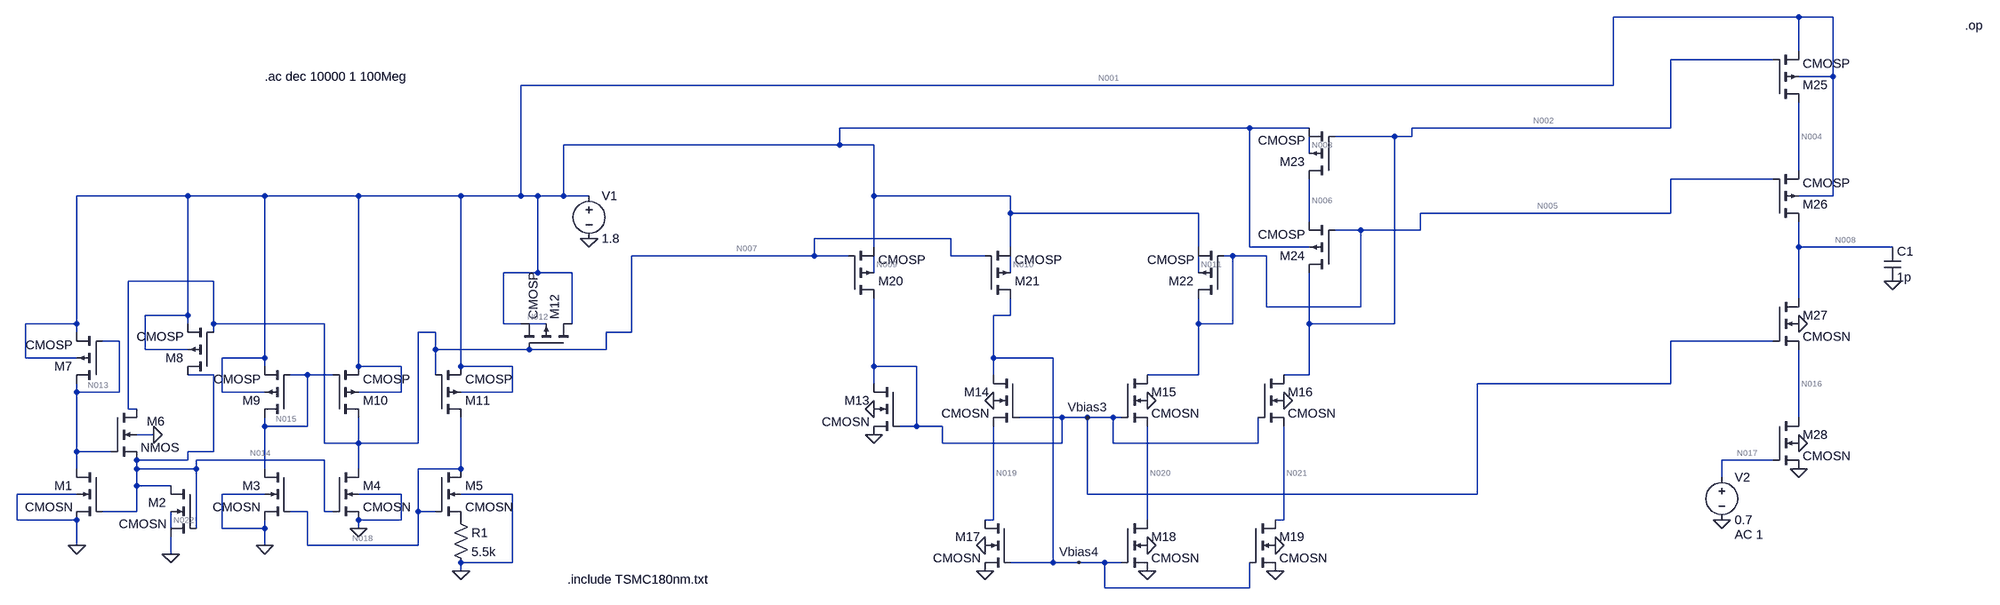
[diagram p0: schematic 180nm.asc]
180nm.asc, the LTspice schematic file:
Version 4
SHEET 1 4024 680
WIRE 3648 -656 3232 -656
WIRE 3712 -656 3648 -656
WIRE 3648 -592 3648 -656
WIRE 3600 -576 3408 -576
WIRE 3712 -544 3712 -656
WIRE 3712 -544 3648 -544
WIRE 3232 -528 3232 -656
WIRE 3232 -528 848 -528
WIRE 2304 -448 1536 -448
WIRE 2416 -448 2304 -448
WIRE 3408 -448 3408 -576
WIRE 3408 -448 2608 -448
WIRE 2576 -432 2464 -432
WIRE 2608 -432 2608 -448
WIRE 2608 -432 2576 -432
WIRE 1536 -416 1536 -448
WIRE 1536 -416 928 -416
WIRE 1600 -416 1536 -416
WIRE 2416 -400 2416 -432
WIRE 3648 -368 3648 -496
WIRE 3600 -352 3408 -352
WIRE 224 -320 16 -320
WIRE 368 -320 224 -320
WIRE 544 -320 368 -320
WIRE 736 -320 544 -320
WIRE 848 -320 848 -528
WIRE 848 -320 736 -320
WIRE 880 -320 848 -320
WIRE 928 -320 928 -416
WIRE 928 -320 880 -320
WIRE 976 -320 928 -320
WIRE 1600 -320 1600 -416
WIRE 1856 -320 1600 -320
WIRE 3712 -320 3712 -544
WIRE 3712 -320 3648 -320
WIRE 1856 -288 1856 -320
WIRE 2208 -288 1856 -288
WIRE 3408 -288 3408 -352
WIRE 3408 -288 2624 -288
WIRE 2416 -272 2416 -352
WIRE 2512 -256 2464 -256
WIRE 2624 -256 2624 -288
WIRE 2624 -256 2512 -256
WIRE 1744 -240 1488 -240
WIRE 1600 -224 1600 -320
WIRE 1856 -224 1856 -288
WIRE 2208 -224 2208 -288
WIRE 2304 -224 2304 -448
WIRE 2416 -224 2304 -224
WIRE 3648 -224 3648 -272
WIRE 3824 -224 3648 -224
WIRE 1488 -208 1488 -240
WIRE 1488 -208 1056 -208
WIRE 1552 -208 1488 -208
WIRE 1744 -208 1744 -240
WIRE 1808 -208 1744 -208
WIRE 2272 -208 2256 -208
WIRE 2336 -208 2272 -208
WIRE 880 -176 880 -320
WIRE 880 -176 816 -176
WIRE 944 -176 880 -176
WIRE 1600 -176 1600 -208
WIRE 1856 -176 1856 -208
WIRE 2208 -176 2208 -208
WIRE 272 -160 112 -160
WIRE 3648 -128 3648 -224
WIRE 2336 -112 2336 -208
WIRE 2512 -112 2512 -256
WIRE 2512 -112 2336 -112
WIRE 224 -96 224 -320
WIRE 224 -96 144 -96
WIRE 1856 -96 1856 -128
WIRE 1856 -96 1824 -96
WIRE 16 -80 16 -320
WIRE 16 -80 -80 -80
WIRE 224 -80 224 -96
WIRE 272 -80 272 -160
WIRE 480 -80 272 -80
WIRE 816 -80 816 -176
WIRE 848 -80 816 -80
WIRE 896 -80 864 -80
WIRE 944 -80 944 -176
WIRE 2208 -80 2208 -128
WIRE 2272 -80 2272 -208
WIRE 2272 -80 2208 -80
WIRE 2416 -80 2416 -176
WIRE 2576 -80 2576 -432
WIRE 2576 -80 2416 -80
WIRE 16 -64 16 -80
WIRE 272 -64 272 -80
WIRE 688 -64 656 -64
WIRE 1056 -64 1056 -208
WIRE 1056 -64 1008 -64
WIRE 96 -48 64 -48
WIRE 3600 -48 3408 -48
WIRE 144 -32 144 -96
WIRE 224 -32 144 -32
WIRE 688 -32 688 -64
WIRE 864 -32 688 -32
WIRE 1008 -32 1008 -64
WIRE 1008 -32 864 -32
WIRE -80 -16 -80 -80
WIRE 16 -16 -80 -16
WIRE 368 -16 368 -320
WIRE 368 -16 288 -16
WIRE 1824 -16 1824 -96
WIRE 1936 -16 1824 -16
WIRE 368 0 368 -16
WIRE 544 0 544 -320
WIRE 624 0 544 0
WIRE 736 0 736 -320
WIRE 832 0 736 0
WIRE 1600 0 1600 -128
WIRE 1680 0 1600 0
WIRE 272 16 224 16
WIRE 448 16 416 16
WIRE 496 16 448 16
WIRE 688 16 688 -32
WIRE 1824 16 1824 -16
WIRE 2208 16 2208 -80
WIRE 2208 16 2112 16
WIRE 2416 16 2416 -80
WIRE 2416 16 2368 16
WIRE 1600 32 1600 0
WIRE 3408 32 3408 -48
WIRE 3408 32 2784 32
WIRE 16 48 16 32
WIRE 96 48 96 -48
WIRE 96 48 16 48
WIRE 288 48 288 -16
WIRE 368 48 288 48
WIRE 624 48 624 0
WIRE 624 48 544 48
WIRE 832 48 832 0
WIRE 832 48 736 48
WIRE 112 80 112 -160
WIRE 128 80 112 80
WIRE 1952 96 1872 96
WIRE 2000 96 1952 96
WIRE 2048 96 2000 96
WIRE 2064 96 2048 96
WIRE 3648 96 3648 -32
WIRE 368 112 368 96
WIRE 448 112 448 16
WIRE 448 112 368 112
WIRE 1680 112 1680 0
WIRE 1680 112 1648 112
WIRE 1728 112 1680 112
WIRE 160 128 128 128
WIRE 480 144 480 -80
WIRE 544 144 544 96
WIRE 544 144 480 144
WIRE 656 144 656 -64
WIRE 656 144 544 144
WIRE 1728 144 1728 112
WIRE 1952 144 1952 96
WIRE 1952 144 1728 144
WIRE 2048 144 2048 96
WIRE 2320 144 2320 96
WIRE 2320 144 2048 144
WIRE 16 160 16 48
WIRE 80 160 16 160
WIRE 272 160 272 16
WIRE 272 160 224 160
WIRE 224 176 224 160
WIRE 224 176 128 176
WIRE 480 176 240 176
WIRE 3600 176 3504 176
WIRE 16 192 16 160
WIRE 128 192 128 176
WIRE 240 192 240 176
WIRE 240 192 128 192
WIRE 368 192 368 112
WIRE 544 192 544 144
WIRE 736 192 736 96
WIRE 736 192 656 192
WIRE 3504 208 3504 176
WIRE 128 224 128 192
WIRE 192 224 128 224
WIRE 16 240 -96 240
WIRE 368 240 288 240
WIRE 624 240 544 240
WIRE 832 240 736 240
WIRE 2000 240 2000 96
WIRE 2784 240 2784 32
WIRE 2784 240 2000 240
WIRE 128 272 128 224
WIRE 128 272 64 272
WIRE 448 272 416 272
WIRE 480 272 480 176
WIRE 496 272 480 272
WIRE 656 272 656 192
WIRE 688 272 656 272
WIRE -96 288 -96 240
WIRE 16 288 -96 288
WIRE 624 288 624 240
WIRE 624 288 544 288
WIRE 1824 288 1824 112
WIRE 1824 288 1808 288
WIRE 2112 288 2112 112
WIRE 2368 288 2368 112
WIRE 2368 288 2352 288
WIRE 192 304 192 272
WIRE 240 304 240 192
WIRE 288 304 288 240
WIRE 368 304 368 288
WIRE 368 304 288 304
WIRE 544 304 544 288
WIRE 16 336 16 288
WIRE 368 336 368 304
WIRE 448 336 448 272
WIRE 656 336 656 272
WIRE 656 336 448 336
WIRE 192 352 192 320
WIRE 832 368 832 240
WIRE 832 368 736 368
WIRE 1936 368 1936 -16
WIRE 1936 368 1856 368
WIRE 1984 368 1936 368
WIRE 2032 368 1984 368
WIRE 2064 368 2032 368
WIRE 736 384 736 368
WIRE 2032 416 2032 368
WIRE 2304 416 2304 368
WIRE 2304 416 2032 416
FLAG 16 336 0
FLAG 192 352 0
FLAG 368 336 0
FLAG 544 304 0
FLAG 736 384 0
FLAG 160 128 0
FLAG 976 -240 0
FLAG 1600 128 0
FLAG 1600 80 0
FLAG 1824 64 0
FLAG 1808 384 0
FLAG 1808 336 0
FLAG 2112 336 0
FLAG 2112 384 0
FLAG 2352 384 0
FLAG 2352 336 0
FLAG 2368 64 0
FLAG 2112 64 0
FLAG 1984 368 Vbias4
FLAG 2000 96 Vbias3
FLAG 3648 -80 0
FLAG 3648 144 0
FLAG 3648 192 0
FLAG 3504 288 0
FLAG 3824 -160 0
DATAFLAG 3648 -448 ""
DATAFLAG 3648 -608 ""
DATAFLAG 1216 -208 ""
DATAFLAG 2768 -448 ""
DATAFLAG 2768 -288 ""
DATAFLAG 3008 32 ""
DATAFLAG 3648 -192 ""
DATAFLAG 3648 48 ""
SYMBOL nmos4 64 192 M0
SYMATTR InstName M1
SYMATTR Value2 l=2 w=10
SYMATTR Value CMOSN
SYMBOL nmos4 240 224 M0
SYMATTR InstName M2
SYMATTR Value2 l=2 w=10
SYMATTR Value CMOSN
SYMBOL nmos4 416 192 M0
SYMATTR InstName M3
SYMATTR Value2 l=2 w=10
SYMATTR Value CMOSN
SYMBOL nmos4 496 192 R0
SYMATTR InstName M4
SYMATTR Value2 l=2 w=10
SYMATTR Value CMOSN
SYMBOL nmos4 688 192 R0
SYMATTR InstName M5
SYMATTR Value2 l=2 w=30
SYMATTR Value CMOSN
SYMBOL nmos4 80 80 R0
WINDOW 0 67 23 Left 2
SYMATTR InstName M6
SYMATTR Value2 l=2 w=4
SYMBOL res 720 272 R0
SYMATTR InstName R1
SYMATTR Value 5.5k
SYMBOL pmos4 64 32 R180
SYMATTR InstName M7
SYMATTR Value2 l=20 w=10
SYMATTR Value CMOSP
SYMBOL pmos4 272 16 R180
SYMATTR InstName M8
SYMATTR Value2 l=2 w=24
SYMATTR Value CMOSP
SYMBOL pmos4 416 96 R180
SYMATTR InstName M9
SYMATTR Value2 l=2 w=24
SYMATTR Value CMOSP
SYMBOL pmos4 496 96 M180
SYMATTR InstName M10
SYMATTR Value2 l=2 w=24
SYMATTR Value CMOSP
SYMBOL pmos4 688 96 M180
SYMATTR InstName M11
SYMATTR Value2 l=2 w=24
SYMATTR Value CMOSP
SYMBOL pmos4 944 -32 M270
SYMATTR InstName M12
SYMATTR Value2 l=50 w=50
SYMATTR Value CMOSP
SYMBOL voltage 976 -336 R0
WINDOW 123 0 0 Left 0
WINDOW 39 0 0 Left 0
SYMATTR InstName V1
SYMATTR Value 1.8
SYMBOL pmos4 1552 -128 M180
SYMATTR InstName M20
SYMATTR Value2 l=0.36u w=27.89u
SYMATTR Value CMOSP
SYMBOL pmos4 1808 -128 M180
SYMATTR InstName M21
SYMATTR Value2 l=0.36u w=59.56u
SYMATTR Value CMOSP
SYMBOL pmos4 2256 -128 R180
SYMATTR InstName M22
SYMATTR Value2 l=0.36u w=2u
SYMATTR Value CMOSP
SYMBOL pmos4 2464 -352 R180
SYMATTR InstName M23
SYMATTR Value2 l=0.36u w=28.8u
SYMATTR Value CMOSP
SYMBOL pmos4 2464 -176 R180
SYMATTR InstName M24
SYMATTR Value2 l=0.36u w=15u
SYMATTR Value CMOSP
SYMBOL nmos4 1648 32 M0
SYMATTR InstName M13
SYMATTR Value2 l=0.36u w=0.36u
SYMATTR Value CMOSN
SYMBOL nmos4 1872 16 M0
SYMATTR InstName M14
SYMATTR Value2 l=2 w=10
SYMATTR Value CMOSN
SYMBOL nmos4 2064 16 R0
SYMATTR InstName M15
SYMATTR Value2 l=0.36u w=20u
SYMATTR Value CMOSN
SYMBOL nmos4 2320 16 R0
SYMATTR InstName M16
SYMATTR Value2 l=0.36u w=5u
SYMATTR Value CMOSN
SYMBOL nmos4 1856 288 M0
SYMATTR InstName M17
SYMATTR Value2 l=2 w=10
SYMATTR Value CMOSN
SYMBOL nmos4 2064 288 R0
SYMATTR InstName M18
SYMATTR Value2 l=2 w=10
SYMATTR Value CMOSN
SYMBOL nmos4 2304 288 R0
SYMATTR InstName M19
SYMATTR Value2 l=0.36u w=10u
SYMATTR Value CMOSN
SYMBOL pmos4 3600 -496 M180
SYMATTR InstName M25
SYMATTR Value CMOSP
SYMATTR Value2 l=0.36u w=20.52u
SYMBOL pmos4 3600 -272 M180
SYMATTR InstName M26
SYMATTR Value CMOSP
SYMATTR Value2 l=0.36u w=8.28u
SYMBOL nmos4 3600 -128 R0
SYMATTR InstName M27
SYMATTR Value CMOSN
SYMATTR Value2 l=0.36u w=8.64u
SYMBOL nmos4 3600 96 R0
SYMATTR InstName M28
SYMATTR Value CMOSN
SYMATTR Value2 l=0.36u w=10.8u
SYMBOL voltage 3504 192 R0
WINDOW 123 24 124 Left 2
WINDOW 39 0 0 Left 0
SYMATTR Value2 AC 1
SYMATTR InstName V2
SYMATTR Value 0.7
SYMBOL cap 3808 -224 R0
SYMATTR InstName C1
SYMATTR Value 1p
TEXT 936 400 Left 2 !.include TSMC180nm.txt
TEXT 368 -544 Left 2 !.ac dec 10000 1 100Meg
TEXT 3960 -640 Left 2 !.op

The netlist it stands for:
* 180nm.asc
M1 N013 N014 0 0 CMOSN l=2 w=10
M2 N014 N014 0 N022 CMOSN l=2 w=10
M3 N015 N018 0 0 CMOSN l=2 w=10
M4 N007 N014 0 0 CMOSN l=2 w=10
M5 N018 N018 P001 0 CMOSN l=2 w=30
M6 N007 N013 N014 0 NMOS l=2 w=4
R1 P001 0 5.5k
M7 N013 N013 N001 N001 CMOSP l=20 w=10
M8 N014 N007 N001 N001 CMOSP l=2 w=24
M9 N015 N015 N001 N001 CMOSP l=2 w=24
M10 N007 N015 N001 N001 CMOSP l=2 w=24
M11 N018 N007 N001 N001 CMOSP l=2 w=24
M12 N001 N007 N001 N012 CMOSP l=50 w=50
V1 N001 0 1.8
M20 Vbias3 N007 N001 N009 CMOSP l=0.36u w=27.89u
M21 Vbias4 N007 N001 N010 CMOSP l=0.36u w=59.56u
M22 N005 N005 N001 N011 CMOSP l=0.36u w=2u
M23 N006 N002 N001 N003 CMOSP l=0.36u w=28.8u
M24 N002 N005 N006 N001 CMOSP l=0.36u w=15u
M13 Vbias3 Vbias3 0 0 CMOSN l=0.36u w=0.36u
M14 Vbias4 Vbias3 N019 0 CMOSN l=2 w=10
M15 N005 Vbias3 N020 0 CMOSN l=0.36u w=20u
M16 N002 Vbias3 N021 0 CMOSN l=0.36u w=5u
M17 N019 Vbias4 0 0 CMOSN l=2 w=10
M18 N020 Vbias4 0 0 CMOSN l=2 w=10
M19 N021 Vbias4 0 0 CMOSN l=0.36u w=10u
M25 N004 N002 N001 N001 CMOSP l=0.36u w=20.52u
M26 N008 N005 N004 N001 CMOSP l=0.36u w=8.28u
M27 N008 Vbias3 N016 0 CMOSN l=0.36u w=8.64u
M28 N016 N017 0 0 CMOSN l=0.36u w=10.8u
V2 N017 0 0.7 AC 1
C1 N008 0 1p
.model NMOS NMOS
.model PMOS PMOS
.lib standard.mos
.include TSMC180nm.txt
.ac dec 10000 1 100Meg
.op
.backanno
.end

* Results of the author's LTspice run, read from the files saved beside the schematic
* Operating Point, zero values left out:
*   V(n013) = 679.3 mV
*   V(n014) = 472.6 mV
*   V(n022) = 82.69 mV
*   V(n015) = 1.264 V
*   V(n018) = 480.7 mV
*   V(n007) = 1.255 V
*   V(p001) = 43.88 mV
*   V(n001) = 1.8 V
*   V(n012) = 1.689 V
*   V(vbias3) = 1.1 V
*   V(n009) = 1.662 V
*   V(vbias4) = 899.3 mV
*   V(n010) = 1.659 V
*   V(n005) = 401 mV
*   V(n011) = 1.654 V
*   V(n006) = 1.497 V
*   V(n002) = 996.2 mV
*   V(n003) = 1.667 V
*   V(n019) = 213.3 mV
*   V(n020) = 343.9 mV
*   V(n021) = 132.1 mV
*   V(n004) = 1.523 V
*   V(n008) = 1.112 V
*   V(n016) = 304.3 mV
*   V(n017) = 700 mV
*   Id(M26) = -210.6 µA
*   Is(M26) = 210.6 µA
*   Id(M25) = -210.6 µA
*   Is(M25) = 210.6 µA
*   Id(M24) = -360.7 µA
*   Ib(M24) = 1.127 pA
*   Is(M24) = 360.7 µA
*   Id(M23) = -360.7 µA
*   Ib(M23) = -1.667 pA
*   Is(M23) = 360.7 µA
*   Id(M22) = -144.9 µA
*   Ib(M22) = -1.654 pA
*   Is(M22) = 144.9 µA
*   Id(M21) = -116.3 µA
*   Ib(M21) = -1.659 pA
*   Is(M21) = 116.3 µA
*   Id(M20) = -52.76 µA
*   Ib(M20) = -1.662 pA
*   Is(M20) = 52.76 µA
*   Ib(M12) = -1.689 pA
*   Id(M11) = -7.979 µA
*   Ib(M11) = 1.329 pA
*   Is(M11) = 7.979 µA
*   Id(M10) = -7.169 µA
*   Is(M10) = 7.169 µA
*   Id(M9) = -7.169 µA
*   Is(M9) = 7.169 µA
*   Id(M8) = -7.979 µA
*   Ib(M8) = 1.337 pA
*   Is(M8) = 7.979 µA
*   Id(M7) = -6.314 µA
*   Ib(M7) = 1.131 pA
*   Is(M7) = 6.314 µA
*   Id(M28) = 210.6 µA
*   Is(M28) = -210.6 µA
*   Id(M27) = 210.6 µA
*   Ib(M27) = -1.437 pA
*   Is(M27) = -210.6 µA
*   Id(M19) = 360.7 µA
*   Is(M19) = -360.7 µA
*   Id(M18) = 144.9 µA
*   Is(M18) = -144.9 µA
*   Id(M17) = 116.3 µA
*   Is(M17) = -116.3 µA
*   Id(M16) = 360.7 µA
*   Ib(M16) = -1.148 pA
*   Is(M16) = -360.7 µA
*   Id(M15) = 144.9 µA
*   Is(M15) = -144.9 µA
*   Id(M14) = 116.3 µA
*   Ib(M14) = -1.133 pA
*   Is(M14) = -116.3 µA
*   Id(M13) = 52.76 µA
*   Ib(M13) = -1.11 pA
*   Is(M13) = -52.76 µA
*   Id(M5) = 7.979 µA
*   Is(M5) = -7.979 µA
*   Id(M4) = 6.315 µA
*   Ib(M4) = -1.265 pA
*   Is(M4) = -6.315 µA
*   Id(M3) = 7.169 µA
*   Ib(M3) = -1.274 pA
*   Is(M3) = -7.169 µA
*   Id(M2) = 8.833 µA
*   Is(M2) = -8.833 µA
*   Id(M1) = 6.314 µA
*   Is(M1) = -6.314 µA
*   Id(M6) = 854 nA
*   Ib(M6) = -1.748 pA
*   Is(M6) = -854 nA
*   I(R1) = 7.979 µA
*   I(V1) = -921.8 µA
* From the log:
*   Semiconductor Device Operating Points:
*                           --- MOSFET Transistors ---
*   Name:          m6
*   Model:        nmos
*   Id:          8.54e-07
*   Vgs:         2.07e-01
*   Vds:         7.82e-01
*   Vbs:        -4.73e-01
*   Vth:         0.00e+00
*   Vdsat:       2.07e-01
*   Gm:          8.27e-06
*   Gds:         0.00e+00
*   Gmb:         0.00e+00
*   Cbd:         0.00e+00
*   Cbs:         0.00e+00
*   Cgsov:       0.00e+00
*   Cgdov:       0.00e+00
*   Cgbov:       0.00e+00
*   Cgs:         0.00e+00
*   Cgd:         0.00e+00
*   Cgb:         0.00e+00
*                           --- BSIM3 MOSFETS ---
*   Name:        m26         m25         m24         m23         m22
*   Model:      cmosp       cmosp       cmosp       cmosp       cmosp
*   Id:       -2.11e-04   -2.11e-04   -3.61e-04   -3.61e-04   -1.45e-04
*   Vgs:      -1.12e+00   -8.04e-01   -1.10e+00   -8.04e-01   -1.40e+00
*   Vds:      -4.11e-01   -2.77e-01   -5.01e-01   -3.03e-01   -1.40e+00
*   Vbs:       2.77e-01    0.00e+00    3.03e-01   -1.33e-01   -1.46e-01
*   Vth:      -5.36e-01   -4.56e-01   -5.44e-01   -4.17e-01   -4.07e-01
*   Vdsat:    -4.50e-01   -2.72e-01   -4.28e-01   -2.93e-01   -7.00e-01
*   Gm:        5.42e-04    9.96e-04    1.07e-03    1.53e-03    2.42e-04
*   Gds:       1.52e-04    1.79e-04    1.09e-04    2.65e-04    8.67e-06
*   Gmb        1.67e-04    3.18e-04    3.21e-04    4.30e-04    6.65e-05
*   Cbd:       0.00e+00    0.00e+00    0.00e+00    0.00e+00    0.00e+00
*   Cbs:       0.00e+00    0.00e+00    0.00e+00    0.00e+00    0.00e+00
*   Cgsov:     5.26e-15    1.30e-14    9.52e-15    1.83e-14    1.27e-15
*   Cgdov:     5.26e-15    1.30e-14    9.52e-15    1.83e-14    1.27e-15
*   Cgbov:     3.01e-19    3.01e-19    3.01e-19    3.01e-19    3.01e-19
*   dQgdVgb:   2.84e-14    7.07e-14    5.11e-14    9.94e-14    6.85e-15
*   dQgdVdb:  -5.65e-15   -1.39e-14   -9.68e-15   -1.93e-14   -1.26e-15
*   dQgdVsb:  -2.26e-14   -5.59e-14   -4.10e-14   -8.02e-14   -5.66e-15
*   dQddVgb:  -1.25e-14   -3.10e-14   -2.24e-14   -4.35e-14   -2.96e-15
*   dQddVdb:   5.67e-15    1.40e-14    9.72e-15    1.95e-14    1.27e-15
*   dQddVsb:   8.87e-15    2.27e-14    1.62e-14    3.09e-14    2.15e-15
*   dQbdVgb:  -3.32e-15   -8.62e-15   -6.32e-15   -1.25e-14   -9.28e-16
*   dQbdVdb:  -4.43e-16   -1.03e-15   -2.42e-16   -1.34e-15   -6.90e-19
*   dQbdVsb:  -4.51e-16   -2.51e-15   -9.57e-16    8.59e-17    9.47e-17
*   Name:        m21         m20         m12         m11         m10
*   Model:      cmosp       cmosp       cmosp       cmosp       cmosp
*   Id:       -1.16e-04   -5.28e-05    8.44e-13   -7.98e-06   -7.17e-06
*   Vgs:      -5.45e-01   -5.45e-01   -5.45e-01   -5.45e-01   -5.36e-01
*   Vds:      -9.01e-01   -7.00e-01    0.00e+00   -1.32e+00   -5.45e-01
*   Vbs:      -1.41e-01   -1.38e-01   -1.11e-01    0.00e+00    0.00e+00
*   Vth:      -4.13e-01   -4.14e-01   -3.56e-01   -3.91e-01   -3.91e-01
*   Vdsat:    -1.17e-01   -1.16e-01   -1.48e-01   -1.28e-01   -1.22e-01
*   Gm:        1.52e-03    6.94e-04    0.00e+00    9.53e-05    8.93e-05
*   Gds:       1.31e-05    6.85e-06    1.21e-05    9.18e-10    1.72e-08
*   Gmb        3.96e-04    1.81e-04    0.00e+00    2.97e-05    2.79e-05
*   Cbd:       0.00e+00    0.00e+00    0.00e+00    0.00e+00    0.00e+00
*   Cbs:       0.00e+00    0.00e+00    0.00e+00    0.00e+00    0.00e+00
*   Cgsov:     3.78e-14    1.77e-14    3.17e-08    1.52e-08    1.52e-08
*   Cgdov:     3.78e-14    1.77e-14    3.17e-08    1.52e-08    1.52e-08
*   Cgbov:     3.01e-19    3.01e-19    5.00e-11    2.00e-12    2.00e-12
*   dQgdVgb:   2.01e-13    9.42e-14    2.11e+01    3.17e-01    3.16e-01
*   dQgdVdb:  -3.76e-14   -1.76e-14   -9.00e+00   -1.09e-05   -1.75e-04
*   dQgdVsb:  -1.62e-13   -7.57e-14   -1.28e+01   -3.01e-01   -3.00e-01
*   dQddVgb:  -8.65e-14   -4.05e-14   -1.04e+01   -1.33e-01   -1.32e-01
*   dQddVdb:   3.77e-14    1.77e-14    7.20e+00    8.53e-06    1.37e-04
*   dQddVsb:   6.22e-14    2.91e-14    6.29e+00    1.75e-01    1.75e-01
*   dQbdVgb:  -2.82e-14   -1.32e-14   -1.84e-01   -5.19e-02   -5.19e-02
*   dQbdVdb:   1.46e-17    2.06e-18   -5.39e+00   -6.15e-06   -9.91e-05
*   dQbdVsb:  -5.67e-16   -3.08e-16    2.27e-01   -4.98e-02   -4.99e-02
*   Name:        m9          m8          m7          m28         m27
*   Model:      cmosp       cmosp       cmosp       cmosn       cmosn
*   Id:       -7.17e-06   -7.98e-06   -6.31e-06    2.11e-04    2.11e-04
*   Vgs:      -5.36e-01   -5.45e-01   -1.12e+00    7.00e-01    7.96e-01
*   Vds:      -5.36e-01   -1.33e+00   -1.12e+00    3.04e-01    8.08e-01
*   Vbs:       0.00e+00    0.00e+00    0.00e+00    0.00e+00   -3.04e-01
*   Vth:      -3.91e-01   -3.91e-01   -3.91e-01    4.65e-01    5.47e-01
*   Vdsat:    -1.22e-01   -1.28e-01   -5.61e-01    1.69e-01    1.84e-01
*   Gm:        8.93e-05    9.53e-05    1.63e-05    1.64e-03    1.52e-03
*   Gds:       1.83e-08    9.00e-10    6.39e-09    8.07e-05    2.00e-05
*   Gmb        2.79e-05    2.97e-05    5.49e-06    4.43e-04    3.67e-04
*   Cbd:       0.00e+00    0.00e+00    0.00e+00    0.00e+00    0.00e+00
*   Cbs:       0.00e+00    0.00e+00    0.00e+00    0.00e+00    0.00e+00
*   Cgsov:     1.52e-08    1.52e-08    6.35e-09    8.89e-15    7.11e-15
*   Cgdov:     1.52e-08    1.52e-08    6.35e-09    8.89e-15    7.11e-15
*   Cgbov:     2.00e-12    2.00e-12    2.00e-11    3.26e-19    3.26e-19
*   dQgdVgb:   3.16e-01    3.17e-01    1.33e+00    4.30e-14    3.41e-14
*   dQgdVdb:  -1.85e-04   -1.07e-05   -1.21e-03   -8.91e-15   -7.03e-15
*   dQgdVsb:  -3.00e-01   -3.01e-01   -1.31e+00   -3.25e-14   -2.59e-14
*   dQddVgb:  -1.32e-01   -1.33e-01   -5.63e-01   -1.89e-14   -1.50e-14
*   dQddVdb:   1.45e-04    8.36e-06    9.46e-04    8.97e-15    7.07e-15
*   dQddVsb:   1.75e-01    1.75e-01    7.43e-01    1.30e-14    1.00e-14
*   dQbdVgb:  -5.19e-02   -5.19e-02   -2.08e-01   -5.25e-15   -4.08e-15
*   dQbdVdb:  -1.05e-04   -6.04e-06   -6.84e-04   -1.37e-16    2.09e-18
*   dQbdVsb:  -4.99e-02   -4.98e-02   -1.73e-01   -2.27e-15   -1.24e-15
*   Name:        m19         m18         m17         m16         m15
*   Model:      cmosn       cmosn       cmosn       cmosn       cmosn
*   Id:        3.61e-04    1.45e-04    1.16e-04    3.61e-04    1.45e-04
*   Vgs:       8.99e-01    8.99e-01    8.99e-01    9.68e-01    7.56e-01
*   Vds:       1.32e-01    3.44e-01    2.13e-01    8.64e-01    5.71e-02
*   Vbs:       0.00e+00    0.00e+00    0.00e+00   -1.32e-01   -3.44e-01
*   Vth:       4.66e-01    3.66e-01    3.66e-01    4.99e-01    5.62e-01
*   Vdsat:     2.65e-01    3.94e-01    3.94e-01    2.84e-01    1.54e-01
*   Gm:        9.82e-04    4.81e-04    3.07e-04    1.28e-03    9.42e-04
*   Gds:       1.99e-03    1.10e-04    3.38e-04    2.52e-05    2.00e-03
*   Gmb        2.80e-04    1.28e-04    8.64e-05    3.24e-04    2.31e-04
*   Cbd:       0.00e+00    0.00e+00    0.00e+00    0.00e+00    0.00e+00
*   Cbs:       0.00e+00    0.00e+00    0.00e+00    0.00e+00    0.00e+00
*   Cgsov:     8.23e-15    8.23e-09    8.23e-09    4.12e-15    1.65e-14
*   Cgdov:     8.23e-15    8.23e-09    8.23e-09    4.12e-15    1.65e-14
*   Cgbov:     3.26e-19    2.00e-12    2.00e-12    3.26e-19    3.26e-19
*   dQgdVgb:   4.27e-14    1.43e-01    1.59e-01    1.98e-14    8.54e-14
*   dQgdVdb:  -1.49e-14   -1.31e-02   -4.29e-02   -4.07e-15   -2.94e-14
*   dQgdVsb:  -2.72e-14   -1.25e-01   -1.13e-01   -1.51e-14   -5.47e-14
*   dQddVgb:  -2.05e-14   -6.32e-02   -7.56e-02   -8.70e-15   -4.13e-14
*   dQddVdb:   1.53e-14    1.07e-02    3.50e-02    4.09e-15    2.96e-14
*   dQddVsb:   8.80e-15    7.19e-02    6.30e-02    5.90e-15    1.80e-14
*   dQbdVgb:  -1.62e-15   -1.70e-02   -7.35e-03   -2.41e-15   -2.78e-15
*   dQbdVdb:  -7.54e-15   -8.30e-03   -2.72e-02   -1.19e-18   -1.33e-14
*   dQbdVsb:   1.36e-15   -1.87e-02   -1.27e-02   -7.99e-16    2.21e-15
*   Name:        m14         m13         m5          m4          m3
*   Model:      cmosn       cmosn       cmosn       cmosn       cmosn
*   Id:        1.16e-04    5.28e-05    7.98e-06    6.32e-06    7.17e-06
*   Vgs:       8.87e-01    1.10e+00    4.37e-01    4.73e-01    4.81e-01
*   Vds:       6.86e-01    1.10e+00    4.37e-01    1.25e+00    1.26e+00
*   Vbs:      -2.13e-01    0.00e+00   -4.39e-02    0.00e+00    0.00e+00
*   Vth:       4.30e-01    4.40e-01    3.80e-01    3.66e-01    3.66e-01
*   Vdsat:     3.51e-01    3.47e-01    6.73e-02    9.24e-02    9.72e-02
*   Gm:        5.03e-04    1.26e-04    1.58e-04    1.01e-04    1.11e-04
*   Gds:       5.06e-07    2.73e-06    2.87e-08    7.83e-10    8.80e-10
*   Gmb        1.23e-04    3.22e-05    4.45e-05    2.87e-05    3.13e-05
*   Cbd:       0.00e+00    0.00e+00    0.00e+00    0.00e+00    0.00e+00
*   Cbs:       0.00e+00    0.00e+00    0.00e+00    0.00e+00    0.00e+00
*   Cgsov:     8.23e-09    2.96e-16    2.47e-08    8.23e-09    8.23e-09
*   Cgdov:     8.23e-09    2.96e-16    2.47e-08    8.23e-09    8.23e-09
*   Cgbov:     2.00e-12    3.26e-19    2.00e-12    2.00e-12    2.00e-12
*   dQgdVgb:   1.33e-01    1.43e-15    3.57e-01    1.31e-01    1.31e-01
*   dQgdVdb:  -3.05e-04   -2.92e-16   -1.33e-04   -3.29e-06   -3.48e-06
*   dQgdVsb:  -1.26e-01   -1.11e-15   -3.10e-01   -1.18e-01   -1.20e-01
*   dQddVgb:  -5.64e-02   -6.26e-16   -1.40e-01   -5.34e-02   -5.39e-02
*   dQddVdb:   2.38e-04    2.94e-16    1.08e-04    2.68e-06    2.85e-06
*   dQddVsb:   7.22e-02    4.36e-16    1.84e-01    7.04e-02    7.11e-02
*   dQbdVgb:  -2.06e-02   -1.79e-16   -7.65e-02   -2.38e-02   -2.36e-02
*   dQbdVdb:  -1.71e-04    1.85e-19   -8.20e-05   -2.07e-06   -2.20e-06
*   dQbdVsb:  -1.87e-02   -5.59e-17   -5.84e-02   -2.24e-02   -2.26e-02
*   Name:        m2          m1
*   Model:      cmosn       cmosn
*   Id:        8.83e-06    6.31e-06
*   Vgs:       4.73e-01    4.73e-01
*   Vds:       4.73e-01    6.79e-01
*   Vbs:       8.27e-02    0.00e+00
*   Vth:       3.41e-01    3.66e-01
*   Vdsat:     1.05e-01    9.24e-02
*   Gm:        1.26e-04    1.01e-04
*   Gds:       3.19e-08    5.88e-09
*   Gmb        3.20e-05    2.87e-05
*   Cbd:       0.00e+00    0.00e+00
*   Cbs:       0.00e+00    0.00e+00
*   Cgsov:     8.23e-09    8.23e-09
*   Cgdov:     8.23e-09    8.23e-09
*   Cgbov:     2.00e-12    2.00e-12
*   dQgdVgb:   1.34e-01    1.31e-01
*   dQgdVdb:  -9.10e-05   -2.21e-05
*   dQgdVsb:  -1.25e-01   -1.18e-01
*   dQddVgb:  -5.48e-02   -5.34e-02
*   dQddVdb:   7.58e-05    1.81e-05
*   dQddVsb:   7.06e-02    7.04e-02
*   dQbdVgb:  -2.40e-02   -2.37e-02
*   dQbdVdb:  -6.06e-05   -1.40e-05
*   dQbdVsb:  -1.61e-02   -2.24e-02